# Altium schematic sheet _accel_mag.SchDoc
size Tabloid
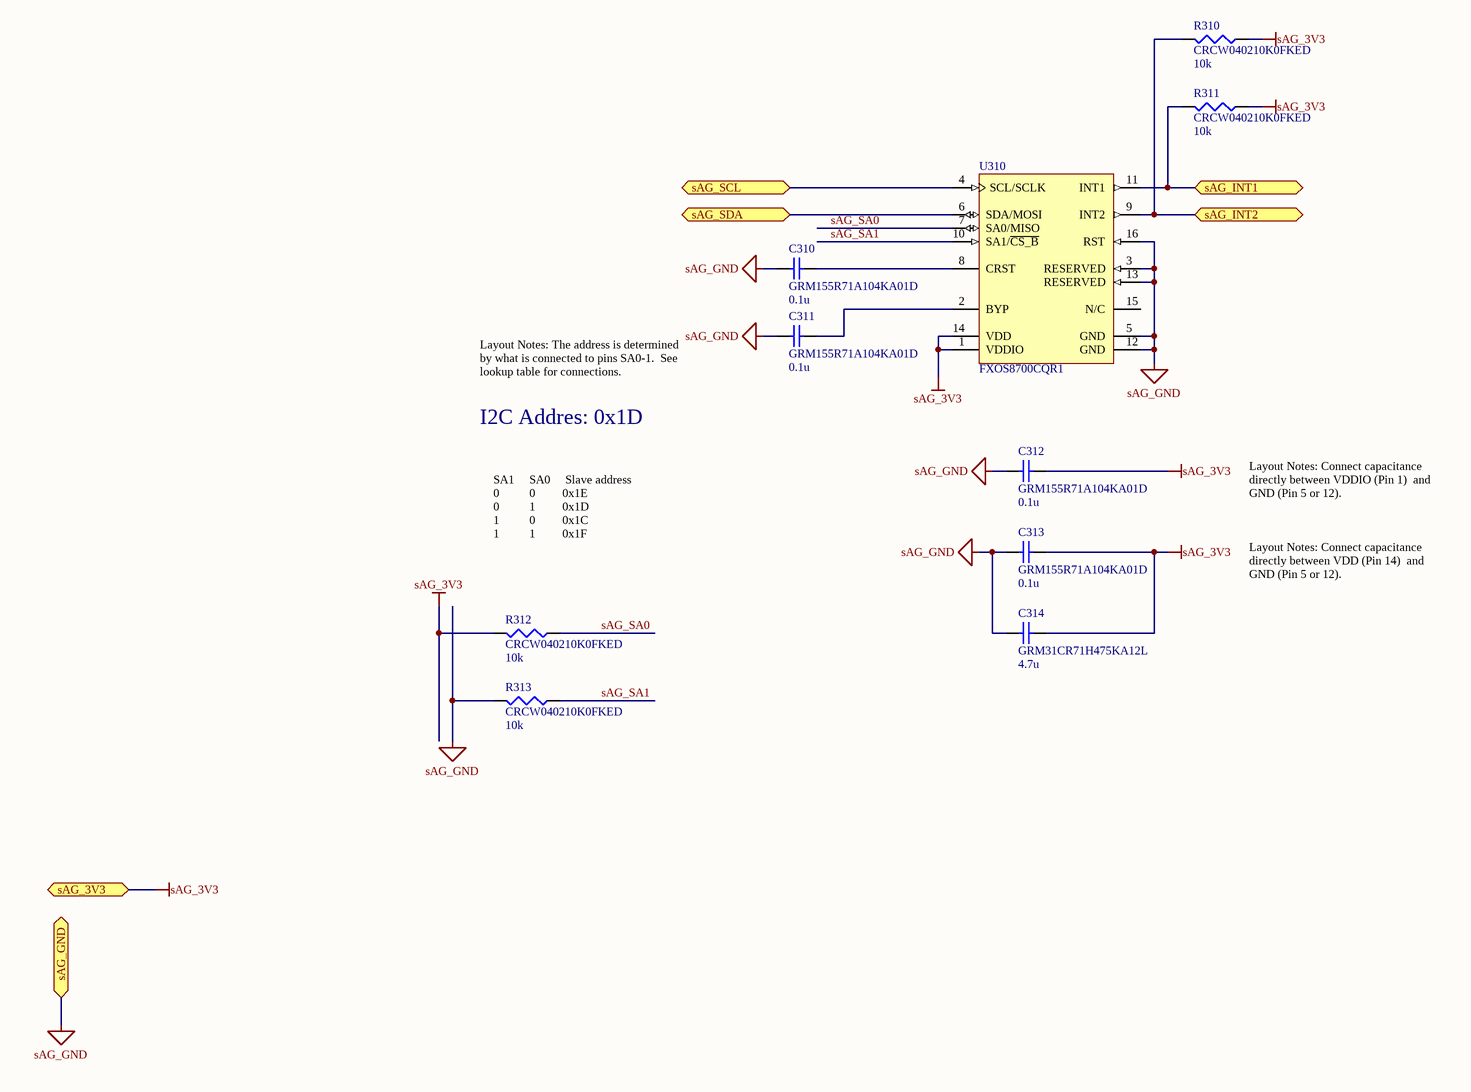
[diagram p0: _accel_mag.SchDoc]

## Parts
C310  GRM155R71A104KA01D  value 0.1u  [0402]
C311  GRM155R71A104KA01D  value 0.1u  [0402]
C312  GRM155R71A104KA01D  value 0.1u  [0402]
C313  GRM155R71A104KA01D  value 0.1u  [0402]
C314  GRM31CR71H475KA12L  value 4.7u  [1206]
R310  CRCW040210K0FKED  value 10k  [0402]
R311  CRCW040210K0FKED  value 10k  [0402]
R312  CRCW040210K0FKED  value 10k  [0402]
R313  CRCW040210K0FKED  value 10k  [0402]
U310  FXOS8700CQR1  [FREE-QFN-16-3000X3000DE_V]

## Ports
sAG_3V3, sAG_GND, sAG_INT1, sAG_INT2, sAG_SCL, sAG_SDA

## Nets
sAG_3V3: C312.2 C313.2 C314.2 R310.1 R311.1 R312.2 U310.1(VDDIO) U310.14(VDD) ; port sAG_3V3
sAG_GND: C310.2 C311.2 C312.1 C313.1 C314.1 R313.2 U310.3(RESERVED) U310.5(GND) U310.12(GND) U310.13(RESERVED) U310.16(RST) ; port sAG_GND
sAG_INT1: R311.2 U310.11(INT1) ; port sAG_INT1
sAG_INT2: R310.2 U310.9(INT2) ; port sAG_INT2
sAG_SA0: R312.1 U310.7(SA0/MISO)
sAG_SA1: R313.1 U310.10(SA1/~{CS_B})
sAG_SCL: U310.4(SCL/SCLK) ; port sAG_SCL
sAG_SDA: U310.6(SDA/MOSI) ; port sAG_SDA
NetC310_1: C310.1 U310.8(CRST)
NetC311_1: C311.1 U310.2(BYP)

Not connected (* = marked no-connect by the designer): U310 15(N/C)

## Notes on the sheet
- Layout Notes: The address is determined by what is connected to pins SA0-1.  See lookup table for connections.
- I2C Addres: 0x1D
- Layout Notes: Connect capacitance directly between VDDIO (Pin 1)  and GND (Pin 5 or 12).
- SA1     SA0     Slave address
  0          0         0x1E
  0          1         0x1D
  1          0         0x1C
  1          1         0x1F
- Layout Notes: Connect capacitance directly between VDD (Pin 14)  and GND (Pin 5 or 12).

## Library data of the parts
C310-C313 = GRM155R71AxxxKdddd: -55-125C, 1005, 10V, X7R, ±10%
C314 = GRM31CR71HxxxKdddd: -55-125C, 3216, 50V, X7R, ±10%
R310-R313 = CRCW0402xxxxFKED: 0.125W, -55-155C, 1005, 50V, ±1%
U310 = CMP-2000-05129-1: 6-Axis Xtrinsic Sensor with Integrated Linear Accelerometer and Magnetometer, 1.95 to 3.6 V, -40 to 85 degC, 16-Pin QFN, RoHS, Tape and Reel; Manufacturer: Freescale; Supply Voltage - Min: 1.95V; Operating Supply Voltage: 1.95Vto3.6V; Unit Weight: 0.000808oz; Supply Voltage - Max: 3.6V; Brand: FreescaleSemiconductor; Sensing Axis: X,Y,Z; Output Type: Digital; Package / Case: QFN-16; Datasheet Version: Rev. 1, 06/2012; Factory Pack Quantity: 1000; Mounting Style: SMD/SMT; Datasheet URL: https://datasheet.ciiva.com/12175/fxos8700cq-60595-12175213.pdf; Type: 6AxisSensor; Maximum Operating Temperature: +85C; Manufacturer URL: http://www.nxp.com/; Package Description: 16-Pin Quad Flat No-lead Package, Body 3 x 3 mm, Pitch 0.5 mm; RoHS: Details; Package Reference: QFN-16; Tradename: Xtrinsic; Packaging: Reel; Minimum Operating Temperature: -40C; Product Category: BoardMountAccelerationSensors